# Altium project PCB_IC.PrjPCB
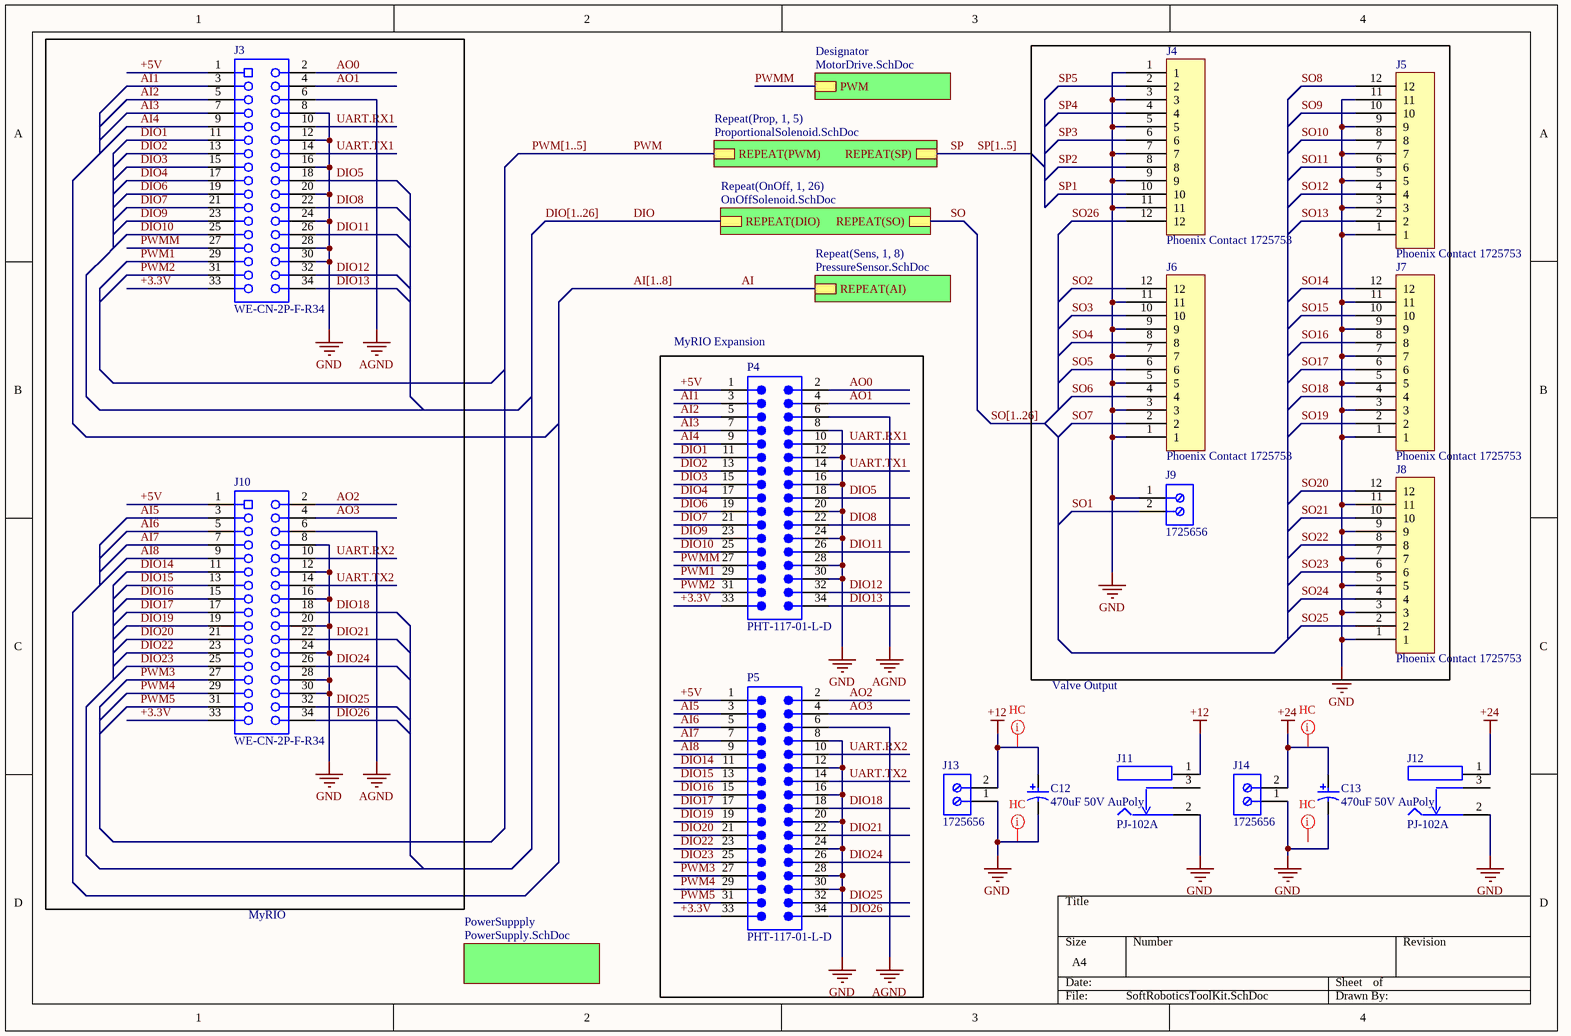
[diagram p0: SoftRoboticsToolKit.SchDoc]
6 sheets, 429 parts. Net scope: hierarchical (ports join the sheet entries above them; power ports are global).
Board file: PCB_IC.PcbDoc
Sheets:
  SoftRoboticsToolKit.SchDoc
    Designator = MotorDrive.SchDoc
    PowerSuppply = PowerSupply.SchDoc
    Prop1 = ProportionalSolenoid.SchDoc
    Prop2 = ProportionalSolenoid.SchDoc
    Prop3 = ProportionalSolenoid.SchDoc
    Prop4 = ProportionalSolenoid.SchDoc
    Prop5 = ProportionalSolenoid.SchDoc
    OnOff1 = OnOffSolenoid.SchDoc
    OnOff2 = OnOffSolenoid.SchDoc
    OnOff3 = OnOffSolenoid.SchDoc
    OnOff4 = OnOffSolenoid.SchDoc
    OnOff5 = OnOffSolenoid.SchDoc
    OnOff6 = OnOffSolenoid.SchDoc
    OnOff7 = OnOffSolenoid.SchDoc
    OnOff8 = OnOffSolenoid.SchDoc
    OnOff9 = OnOffSolenoid.SchDoc
    OnOff10 = OnOffSolenoid.SchDoc
    OnOff11 = OnOffSolenoid.SchDoc
    OnOff12 = OnOffSolenoid.SchDoc
    OnOff13 = OnOffSolenoid.SchDoc
    OnOff14 = OnOffSolenoid.SchDoc
    OnOff15 = OnOffSolenoid.SchDoc
    OnOff16 = OnOffSolenoid.SchDoc
    OnOff17 = OnOffSolenoid.SchDoc
    OnOff18 = OnOffSolenoid.SchDoc
    OnOff19 = OnOffSolenoid.SchDoc
    OnOff20 = OnOffSolenoid.SchDoc
    OnOff21 = OnOffSolenoid.SchDoc
    OnOff22 = OnOffSolenoid.SchDoc
    OnOff23 = OnOffSolenoid.SchDoc
    OnOff24 = OnOffSolenoid.SchDoc
    OnOff25 = OnOffSolenoid.SchDoc
    OnOff26 = OnOffSolenoid.SchDoc
    Sens1 = PressureSensor.SchDoc
    Sens2 = PressureSensor.SchDoc
    Sens3 = PressureSensor.SchDoc
    Sens4 = PressureSensor.SchDoc
    Sens5 = PressureSensor.SchDoc
    Sens6 = PressureSensor.SchDoc
    Sens7 = PressureSensor.SchDoc
    Sens8 = PressureSensor.SchDoc

## Sheet SoftRoboticsToolKit.SchDoc
size A4

### Parts
C12  470uF 50V AuPoly  [CAPAE137130X163M]
C13  470uF 50V AuPoly  [CAPAE137130X163M]
J3  WE-CN-2P-F-R34  [613034243121]
J4  Phoenix Contact 1725753  [PHOE-1725656-12]
J5  Phoenix Contact 1725753  [PHOE-1725656-12]
J6  Phoenix Contact 1725753  [PHOE-1725656-12]
J7  Phoenix Contact 1725753  [PHOE-1725656-12]
J8  Phoenix Contact 1725753  [PHOE-1725656-12]
J9  1725656  [PHOE-1725656-2]
J10  WE-CN-2P-F-R34  [613034243121]
J11  PJ-102A  [FP-PJ-102A-MFG]
J12  PJ-102A  [FP-PJ-102A-MFG]
J13  1725656  [PHOE-1725656-2]
J14  1725656  [PHOE-1725656-2]
P4  PHT-117-01-L-D  [PHT-117-01-L-D]
P5  PHT-117-01-L-D  [PHT-117-01-L-D]

### Blocks framed on the sheet
MyRIO Expansion: P4 P5

### Sub-sheets
Designator = MotorDrive.SchDoc: PWM
PowerSuppply = PowerSupply.SchDoc: no entries
Repeat(OnOff, 1, 26) = OnOffSolenoid.SchDoc: REPEAT(DIO), REPEAT(SO)
Repeat(Prop, 1, 5) = ProportionalSolenoid.SchDoc: REPEAT(PWM), REPEAT(SP)
Repeat(Sens, 1, 8) = PressureSensor.SchDoc: REPEAT(AI)

### Nets
+12: C12.1 J11.1 J13.2
+24: C13.1 J12.1 J14.2
AGND: J3.6 J10.6 P4.6 P5.6
GND: C12.2 C13.2 J3.8 J3.12 J3.16 J3.20 J3.24 J3.28 J3.30 J4.1 J4.3 J4.5 J4.7 J4.9 J4.11 J5.1 J5.3 J5.5 J5.7 J5.9 J5.11 J6.1 J6.3 J6.5 J6.7 J6.9 J6.11 J7.1 J7.3 J7.5 J7.7 J7.9 J7.11 J8.1 J8.3 J8.5 J8.7 J8.9 J8.11 J9.1 J10.8 J10.12 J10.16 J10.20 J10.24 J10.28 J10.30 J11.2 J12.2 J13.1 J14.1 P4.8 P4.12 P4.16 P4.20 P4.24 P4.28 P4.30 P5.8 P5.12 P5.16 P5.20 P5.24 P5.28 P5.30
+3.3V: J3.33 J10.33 P4.33 P5.33
+5V: J3.1 J10.1 P4.1 P5.1
AI: sheet Repeat(Sens, 1, 8)/REPEAT(AI)
AI1: J3.3 P4.3
AI2: J3.5 P4.5
AI3: J3.7 P4.7
AI4: J3.9 P4.9
AI5: J10.3 P5.3
AI6: J10.5 P5.5
AI7: J10.7 P5.7
AI8: J10.9 P5.9
AO0: J3.2 P4.2
AO1: J3.4 P4.4
AO2: J10.2 P5.2
AO3: J10.4 P5.4
DIO: sheet Repeat(OnOff, 1, 26)/REPEAT(DIO)
DIO1: J3.11 P4.11
DIO2: J3.13 P4.13
DIO3: J3.15 P4.15
DIO4: J3.17 P4.17
DIO5: J3.18 P4.18
DIO6: J3.19 P4.19
DIO7: J3.21 P4.21
DIO8: J3.22 P4.22
DIO9: J3.23 P4.23
DIO10: J3.25 P4.25
DIO11: J3.26 P4.26
DIO12: J3.32 P4.32
DIO13: J3.34 P4.34
DIO14: J10.11 P5.11
DIO15: J10.13 P5.13
DIO16: J10.15 P5.15
DIO17: J10.17 P5.17
DIO18: J10.18 P5.18
DIO19: J10.19 P5.19
DIO20: J10.21 P5.21
DIO21: J10.22 P5.22
DIO22: J10.23 P5.23
DIO23: J10.25 P5.25
DIO24: J10.26 P5.26
DIO25: J10.32 P5.32
DIO26: J10.34 P5.34
PWM: sheet Repeat(Prop, 1, 5)/REPEAT(PWM)
PWM1: J3.29 P4.29
PWM2: J3.31 P4.31
PWM3: J10.27 P5.27
PWM4: J10.29 P5.29
PWM5: J10.31 P5.31
PWMM: J3.27 P4.27 ; sheet Designator/PWM
SO: sheet Repeat(OnOff, 1, 26)/REPEAT(SO)
SO1: J9.2
SO2: J6.12
SO3: J6.10
SO4: J6.8
SO5: J6.6
SO6: J6.4
SO7: J6.2
SO8: J5.12
SO9: J5.10
SO10: J5.8
SO11: J5.6
SO12: J5.4
SO13: J5.2
SO14: J7.12
SO15: J7.10
SO16: J7.8
SO17: J7.6
SO18: J7.4
SO19: J7.2
SO20: J8.12
SO21: J8.10
SO22: J8.8
SO23: J8.6
SO24: J8.4
SO25: J8.2
SO26: J4.12
SP: sheet Repeat(Prop, 1, 5)/REPEAT(SP)
SP1: J4.10
SP2: J4.8
SP3: J4.6
SP4: J4.4
SP5: J4.2
UART.RX1: J3.10 P4.10
UART.RX2: J10.10 P5.10
UART.TX1: J3.14 P4.14
UART.TX2: J10.14 P5.14

Not connected (* = marked no-connect by the designer): J11 3; J12 3

### Buses and harness runs
bus AI[1..8]
bus DIO[1..26]
bus PWM[1..5]
bus SO[1..26]
bus SP[1..5]

### Layout directives
net class HC: (no net found under the mark), +12, +24, GND

### Notes on the sheet
- Valve Output
- MyRIO

### Library data of the parts
C12 C13 = C-Poly: Manufacturer: AVX; DELETED: Compliant; Product Depth (mm): 4.3mm; Product Length (mm): 7.3mm; Case Style: Molded; Product Diameter (mm): NotRequiredmm; DF: 6%; Seal: NotRequired; Capacitance: 22000000pF; Product Height (mm): 2.9mm; Rad Hardened: No; ESR: 0.2ohm; Polarity: Polar; DCL: 5.5uA; Voltage: 25VDC; Tolerance (+ or -): 10%; Construction: SMTChip; Mounting Style: SurfaceMount; Packaging: TapeandReel; Case Code: D; Package Reference: 7343-31; Manufacturer URL: http://www.avx.com/; Failure Rate: NotRequired; Insulation: NotRequired; Operating Temp Range: -55Cto125C; Mounting Technology: SurfaceMount; Package Description: 2-Pin Surface Mount Device, Body 7.3 x 4.35 mm; Length W/Weld (max): NotRequiredmm; Lead Spacing (nom): NotRequiredmm; Seated Plane Height: NotRequiredmm; Wire Form: NotRequired; Datasheet Version: 02/2004; Datasheet URL: https://datasheet.ciiva.com/11793/0900766b80066cb4-11793194.pdf; Length W/Weld: NotRequiredmm; Package / Case: 7343-31
J4-J8 = 1725753
J9 J13 J14 = CMP-2000-05299-1: Male Header, Pitch 2.54 mm, 1 x 2 Position, Height 9 mm, Tail Length 3.5 mm; Manufacturer: Phoenix Contact; Number of contacts: 2; Content: 250pc(s); Pitch: 2.54mm; Industrial packaging: Yes; Colour: Green; Manufacturer part No.: 1725656; Type: MPT0,5/2-2,54; Datasheet URL: http://datasheet.octopart.com/1725656-Phoenix-Contact-datasheet-5302866.pdf; Manufacturer URL: http://www.phoenixcontact.com/; Datasheet Version: Apr-08
J11 J12 = CMP-14830-000006-1: CONN PWR JACK 2X5.5MM SOLDER; Manufacturer: CUI; Conn Gender: Male; Voltage: 24V; Industry Recognized Mating Diameter: 2.10mm ID (0.083"), 5.50mm OD (0.217"); Number Of Contacts: 3; Number of Positions/Contacts: 2 Conductors, 3 Contacts; Current Rating: 2.5A; Conn Orientation: Right Angle; ComponentLink2URL: http://www.cui.com/product/resource/pj-102a.pdf; Manufacturer Part Number: PJ-102A; Contact Material: Tin,Nickel; Digikey Description: CONN PWR JACK 2X5.5MM SOLDER; RoHS: TRUE; Height: 11.2mm; Category: Conn; Octopart: https://octopart.com/pj-102a-cui-286936; Device Class L1: Connectors; Automotive: No; Package: PJ-102A; Device Class L2: Power Connectors; Temperature Range Low: -25°C; Temperature: -25°C to +85°C; Mouser Description: DC Power Connectors Power Jacks; Lead Free: Yes; Device Class L3: unset; Voltage Rating: 24V; ComponentLink2Description: Datasheet; Temperature Range High: +85°C

## Sheet MotorDrive.SchDoc
size A4
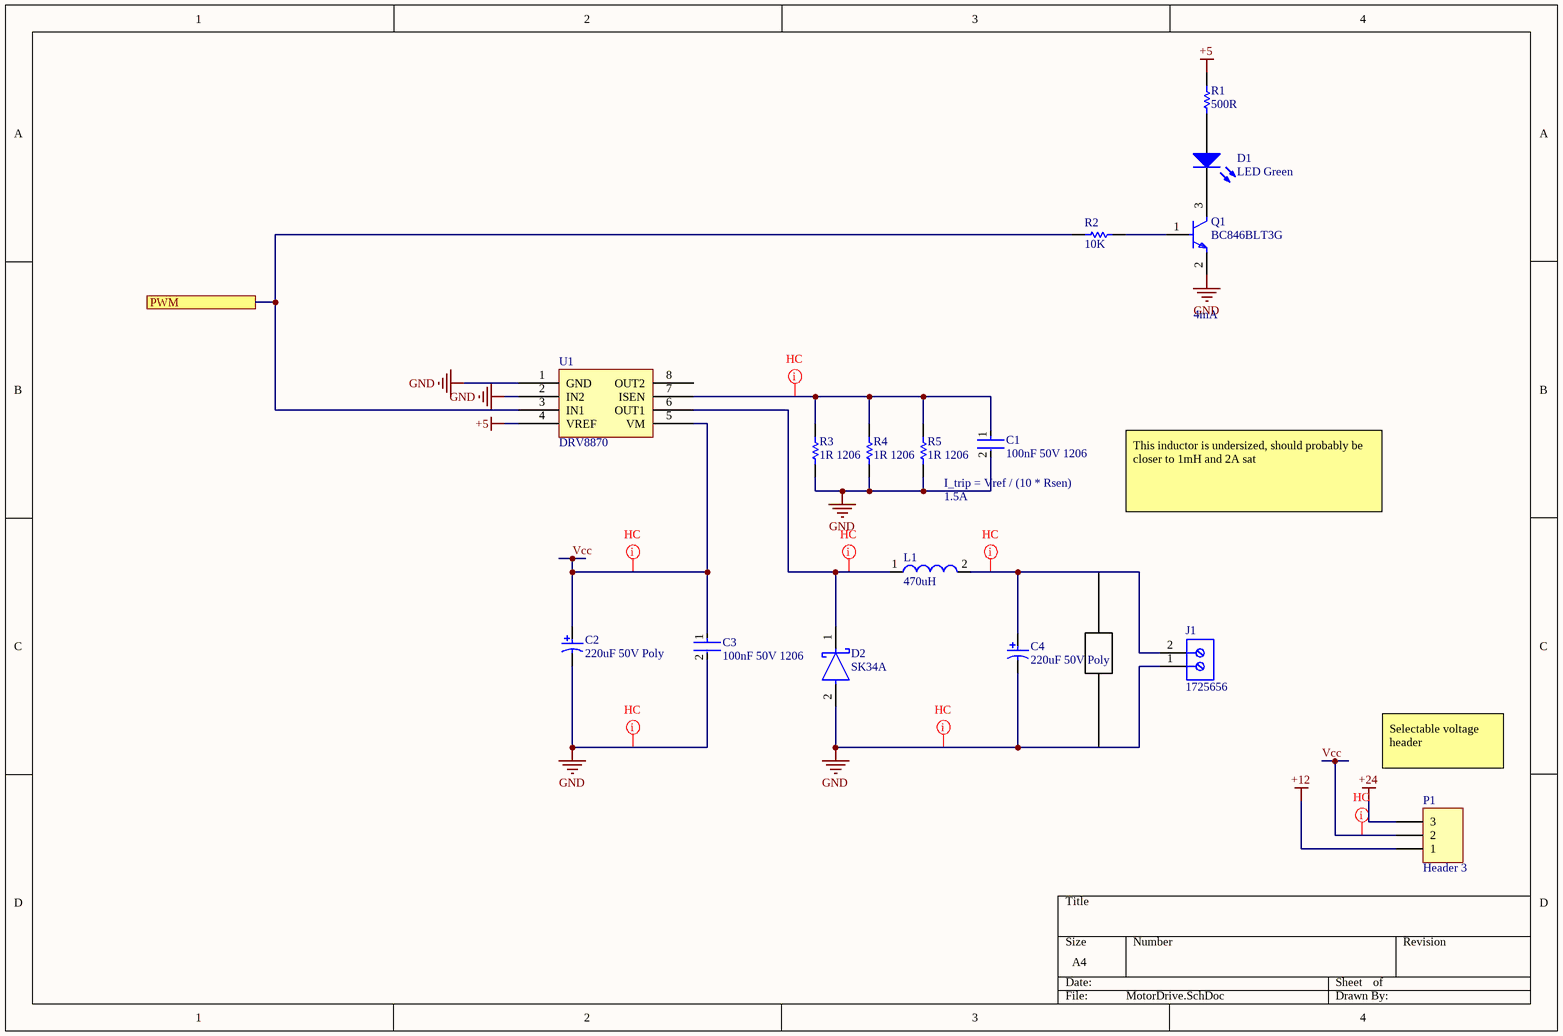
[diagram p1: MotorDrive.SchDoc]

### Parts
C1  100nF 50V 1206  [FP-CL31-IPC_B]
C2  220uF 50V Poly  [CAPAE127P600-8N]
C3  100nF 50V 1206  [FP-CL31-IPC_B]
C4  220uF 50V Poly  [CAPAE127P600-8N]
D1  LED Green  [0603_A]
D2  SK34A  [FP-DO-214AC-MFG]
J1  1725656  [PHOE-1725656-2]
L1  470uH  [L1212]
P1  Header 3  [HDR1X3]
Q1  BC846BLT3G  [FP-318-08-IPC_C]
R1  500R  [RESC0603(1608)_L]
R2  10K  [RESC0603(1608)_N]
R3  1R 1206  [RESC1206(3216)_N]
R4  1R 1206  [RESC1206(3216)_N]
R5  1R 1206  [RESC1206(3216)_N]
U1  DRV8870  [SOIC127P600X170_HS-9N]

### Ports
PWM

### Nets
+5: R1.2 U1.4(VREF)
+12: P1.1
+24: P1.3
GND: C1.2 C2.2 C3.2 C4.2 D2.2(A) J1.1 Q1.2(E) R3.1 R4.1 R5.1 U1.1(GND) U1.2(IN2)
PWMM: R2.1 U1.3(IN1) ; port PWM
Vcc: C2.1 C3.1 P1.2 U1.5(VM)
NetC1_1: C1.1 R3.2 R4.2 R5.2 U1.7(ISEN)
NetC4_1: C4.1 J1.2 L1.2
NetD1_1: D1.1(K) Q1.3(C)
NetD1_2: D1.2(A) R1.1
NetD2_1: D2.1(C) L1.1 U1.6(OUT1)
NetQ1_1: Q1.1(B) R2.2

Not connected (* = marked no-connect by the designer): U1 8(OUT2)

### Layout directives
net class HC: GND, NetC1_1, NetC4_1, NetD2_1, Vcc

### Notes on the sheet
- 4mA
- I_trip = Vref / (10 * Rsen)
- 1.5A
- This inductor is undersized, should probably be closer to 1mH and 2A sat
- Selectable voltage header

### Library data of the parts
C1 C3 = CMP-13271-001276-1: Cap Ceramic 100nF 50V X7R ±10% SMD 1206 +125°C Embossed T/R; Dielectric: X7R; Case Code (Metric): 3216; Package Quantity: 1; Thickness: 0.037inch; Depth: 1.6mm; Packaging: Tape and Reel; Capacitance: 100nF; Length: 0.126inch; Tolerance: 10%; Voltage Rating: 50V; Case Code (Imperial): 1206; Radiation Hardening: No; Width: 0.063inch; Case/Package: 1206; Max Operating Temperature: 125°C; Min Operating Temperature: -55°C; Height: 0.85mm; Mount: Surface Mount
C2 C4 = C-Poly: as C12 on sheet SoftRoboticsToolKit; Construction: SMTChip; Mounting Style: SurfaceMount; Packaging: TapeandReel; Case Code: D; Package Reference: 7343-31; Manufacturer URL: http://www.avx.com/; Failure Rate: NotRequired; Insulation: NotRequired; Operating Temp Range: -55Cto125C; Mounting Technology: SurfaceMount; Package Description: 2-Pin Surface Mount Device, Body 7.3 x 4.35 mm; Length W/Weld (max): NotRequiredmm; Lead Spacing (nom): NotRequiredmm; Seated Plane Height: NotRequiredmm; Wire Form: NotRequired; Datasheet Version: 02/2004; Datasheet URL: https://datasheet.ciiva.com/11793/0900766b80066cb4-11793194.pdf; Length W/Weld: NotRequiredmm; Package / Case: 7343-31
D1 = CMP-1426-00002-1: SMD mono-color Chip LED, WL-SMCW, Green; PartNumber: 150060GS75000; Manufacturer: Wuerth Elektronik; ComponentLink1URL: http://www.we-online.com; ComponentLink2Description: Datasheet; Color: Green; ComponentLink2URL: http://katalog.we-online.com/led/datasheet/150060GS75000.pdf; PackageReference: 0603_A; ComponentLink1Description: Manufacturer URL
D2 = CMP-56206-000004-1: DIODE SCHOTTKY 5A 30V SMA; Mount: Surface Mount; Max Reverse Voltage (DC): 30V; Case/Package: SMA; Packaging: Tape and Reel; Average Rectified Current: 5A
J1 = CMP-2000-05299-1: as J9 on sheet SoftRoboticsToolKit; Colour: Green; Manufacturer part No.: 1725656; Type: MPT0,5/2-2,54; Datasheet URL: http://datasheet.octopart.com/1725656-Phoenix-Contact-datasheet-5302866.pdf; Manufacturer URL: http://www.phoenixcontact.com/; Datasheet Version: Apr-08
L1 = Inductor1212: Manufacturer: Wuerth Elektronik; PartNumber: 74479763215; Inductance: 1.50 ÂµH; ComponentLink1Description: Manufacturer URL; PackageReference: SMD 0603_A; ComponentLink1URL: http://www.we-online.com; ComponentLink2URL: http://katalog.we-online.de/kataloge/eisos/media/pdf/74479763215.pdf; ComponentLink2Description: Datasheet
P1 = Header 3: Header, 3-Pin; LatestRevisionDate: 17-Jul-2002; LatestRevisionNote: Re-released for DXP Platform.; Publisher: Altium Limited
Q1 = CMP-07170-000022-1: TRANS NPN 65V 0.1A SOT-23; Number of Elements: 1; Collector Emitter Saturation Voltage: 600mV; Power Dissipation: 300mW; hFE Min: 200; Transition Frequency: 100MHz; Max Collector Current: 100mA; Collector Base Voltage (VCBO): 80V; Emitter Base Voltage (VEBO): 6V; Element Configuration: Single; REACH SVHC: No SVHC; Length: 2.9mm; Polarity: NPN; Max Breakdown Voltage: 65V; Case/Package: SOT-23-3; Max Operating Temperature: 150°C; Min Operating Temperature: -55°C; Voltage Rating (DC): 65V; Number of Pins: 3; Radiation Hardening: No; Package Quantity: 1; Contact Plating: Tin; Max Frequency: 100MHz; Width: 1.3mm; Max Power Dissipation: 300mW; Height: 1mm; Lead Free: Lead Free; Frequency: 100MHz; Halogen Free: Halogen Free; Collector Emitter Voltage (VCEO): 65V; Gain Bandwidth Product: 100MHz; Current Rating: 100mA; Collector Emitter Breakdown Voltage: 65V; Packaging: Tape and Reel
R1 = CMP-1012-00067-1: 510R 0.1W 5% 0603 (1608 Metric)  SMD; Case-EIA: 0603; Value: 510.00 Ohm; Case-Metric: 1608; Technology: SMT; Power: 0.1 W; Tolerance: 5 %
R2 = CMP-1012-00623-1: 10K 0.1W 1% 0603 (1608 Metric)  SMD; Value: 10000.00 Ohm; Case-EIA: 0603; Case-Metric: 1608; Power: 0.1 W; Tolerance: 1 %; Technology: SMT
R3-R5 = CMP-1014-00004-1: 1R2 0.25W 5% 1206 (3216 Metric)  SMD; Value: 1.20 Ohm; Case-Metric: 3216; Case-EIA: 1206; Power: 0.25 W; Technology: SMT; Tolerance: 5 %

## Sheet PowerSupply.SchDoc
size A4
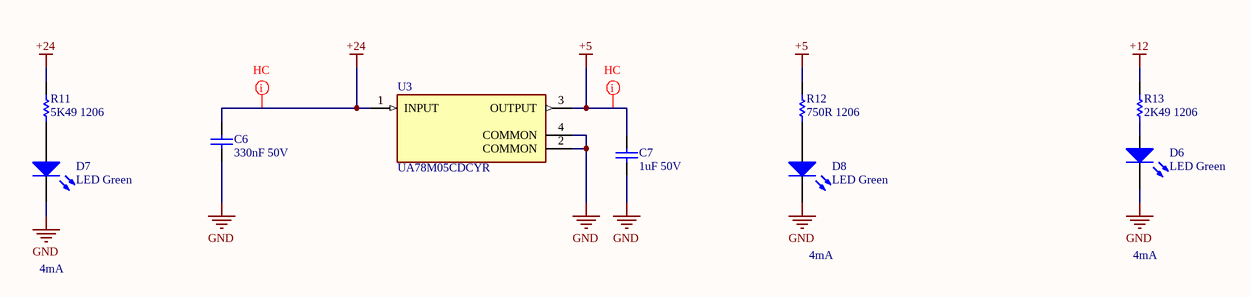
[diagram p2: PowerSupply.SchDoc]

### Parts
C6  330nF 50V  [CAPC0603(1608)100_L]
C7  1uF 50V  [CAPC0603(1608)100_L]
D6  LED Green  [0603_A]
D7  LED Green  [0603_A]
D8  LED Green  [0603_A]
R11  5K49 1206  [R-1206]
R12  750R 1206  [R-1206]
R13  2K49 1206  [R-1206]
U3  UA78M05CDCYR  [FP-DCY0004A-MFG]

### Nets
+5: C7.1 R12.2 U3.3(OUTPUT)
+12: R13.2
+24: C6.2 R11.2 U3.1(INPUT)
GND: C6.1 C7.2 D6.1(K) D7.1(K) D8.1(K) U3.2(COMMON) U3.4(COMMON)
NetD6_2: D6.2(A) R13.1
NetD7_2: D7.2(A) R11.1
NetD8_2: D8.2(A) R12.1

### Layout directives
net class HC: +5, +24

### Notes on the sheet
- 4mA

### Library data of the parts
C6 = CMP-1035-02677-1: CAP 330nF 35V ±10% 0603 (1608 Metric) Thickness 1mm SMD; Case-EIA: 0603; Case-Metric: 1608; Tolerance: Â±10%; Technology: SMT; Max Thickness: 1 mm; Value: 330nF; Rated Voltage: 35 V
C7 = CMP-1035-02743-1: CAP 1uF 35V ±10% 0603 (1608 Metric) Thickness 1mm SMD; Case-Metric: 1608; Case-EIA: 0603; Tolerance: Â±10%; Max Thickness: 1 mm; Value: 1uF; Technology: SMT; Rated Voltage: 35 V
D6-D8 = CMP-1426-00002-1: as D1 on sheet MotorDrive; ComponentLink1URL: http://www.we-online.com; ComponentLink2Description: Datasheet; Color: Green; ComponentLink2URL: http://katalog.we-online.com/led/datasheet/150060GS75000.pdf; PackageReference: 0603_A; ComponentLink1Description: Manufacturer URL
R11-R13 = R-1206: 0.25W 1206; Power: 0.1 W; Value: 10000.00 Ohm; Tolerance: 1 %; Case-EIA: 0603; Case-Metric: 1608; Technology: SMT
U3 = CMP-04917-000015-1: IC REG LINEAR 5V 500MA SOT223-4; Manufacturer: Texas Instruments; Accuracy Percentage: 3%; Dropout Voltage: 2V; Max Supply Voltage: 25V; Min Supply Voltage: 7V; Nominal Supply Current: 4.5mA; Max Junction Temp: +125°C; Number Of Outputs: 1; Output Type: Fixed; Standoff Height: 0.02mm; Automotive: No; ComponentLink2URL: http://www.ti.com/lit/ds/symlink/ua78m.pdf; ComponentLink2Description: Datasheet; Category: IC; Output Voltage: 5V; Lead Free: Yes; Height: 1.8mm; Temperature Range Low: 0°C; Octopart: https://octopart.com/ua78m05cdcyr-texas+instruments-525243; Device Class L3: Voltage Regulators - Linear; Mouser Description: Linear Voltage Regulators 5.0V 500mA Fxd Pos; Device Class L1: Integrated Circuits (ICs); RoHS: TRUE; Output Current: 500mA; Temperature Range High: +125°C; Manufacturer Part Number: UA78M05CDCYR; Device Class L2: Power Management ICs; Digikey Description: IC REG LINEAR 5V 500MA SOT223-4; Package: DCY0004A; Temperature: 0°C to +125°C

## Sheet ProportionalSolenoid.SchDoc
size A4
Used 5 times, as channels Prop1, Prop2, Prop3, Prop4, Prop5. Parts and nets are listed once, with the designators drawn on the sheet.
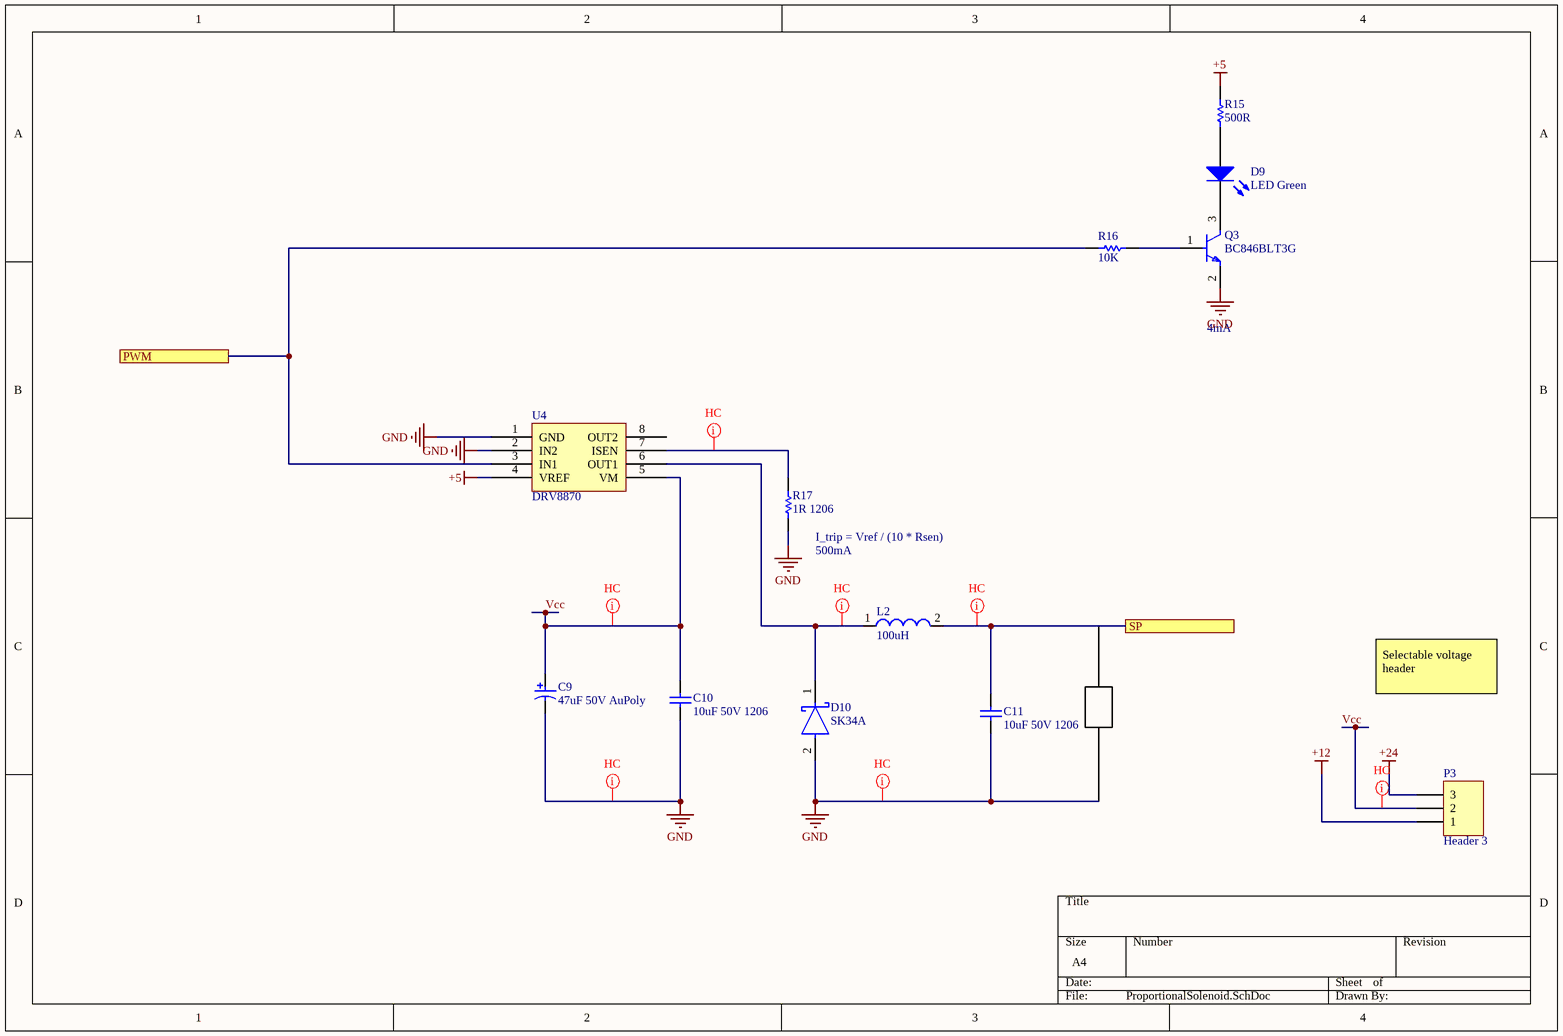
[diagram p3: ProportionalSolenoid.SchDoc]

### Parts
C9  47uF 50V AuPoly  [EEH-ZA1H220P]
C10  10uF 50V 1206  [CAPC1206(3216)190_N]
C11  10uF 50V 1206  [CAPC1206(3216)190_N]
D9  LED Green  [0603_A]
D10  SK34A  [FP-DO-214AC-MFG]
L2  100uH  [L0404]
P3  Header 3  [HDR1X3]
Q3  BC846BLT3G  [FP-318-08-IPC_C]
R15  500R  [RESC0603(1608)_L]
R16  10K  [RESC0603(1608)_N]
R17  1R 1206  [RESC1206(3216)_N]
U4  DRV8870  [SOIC127P600X170_HS-9N]

### Ports
PWM, SP

### Nets
+5: R15.2 U4.4(VREF)
+12: P3.1
+24: P3.3
GND: C9.2 C10.1 C11.1 D10.2(A) Q3.2(E) R17.1 U4.1(GND) U4.2(IN2)
PWM: R16.1 U4.3(IN1) ; port PWM
SP: C11.2 L2.2 ; port SP
Vcc: C9.1 C10.2 P3.2 U4.5(VM)
NetD9_1: D9.1(K) Q3.3(C)
NetD9_2: D9.2(A) R15.1
NetD10_1: D10.1(C) L2.1 U4.6(OUT1)
NetQ3_1: Q3.1(B) R16.2
NetR17_2: R17.2 U4.7(ISEN)

Not connected (* = marked no-connect by the designer): U4 8(OUT2)

### Channels
Prop1: designators end in _Prop1; ports PWM=PWM1 SP=SP1
Prop2: designators end in _Prop2; ports PWM=PWM2 SP=SP2
Prop3: designators end in _Prop3; ports PWM=PWM3 SP=SP3
Prop4: designators end in _Prop4; ports PWM=PWM4 SP=SP4
Prop5: designators end in _Prop5; ports PWM=PWM5 SP=SP5

### Layout directives
net class HC: GND, NetD10_Prop1_1, NetR17_Prop1_2, SP1, Vcc_Prop1

### Notes on the sheet
- 4mA
- (near R17) I_trip = Vref / (10 * Rsen)
- (near R17) 500mA
- Selectable voltage header

### Library data of the parts
C9 = C-Poly: as C12 on sheet SoftRoboticsToolKit; Construction: SMTChip; Mounting Style: SurfaceMount; Packaging: TapeandReel; Case Code: D; Package Reference: 7343-31; Manufacturer URL: http://www.avx.com/; Failure Rate: NotRequired; Insulation: NotRequired; Operating Temp Range: -55Cto125C; Mounting Technology: SurfaceMount; Package Description: 2-Pin Surface Mount Device, Body 7.3 x 4.35 mm; Length W/Weld (max): NotRequiredmm; Lead Spacing (nom): NotRequiredmm; Seated Plane Height: NotRequiredmm; Wire Form: NotRequired; Datasheet Version: 02/2004; Datasheet URL: https://datasheet.ciiva.com/11793/0900766b80066cb4-11793194.pdf; Length W/Weld: NotRequiredmm; Package / Case: 7343-31
C10 C11 = CMP-1037-04983-1: CAP 10uF 50V ±20% 1206 (3216 Metric) Thickness 1.9mm SMD; Tolerance: Â±20%; Case-Metric: 3216; Case-EIA: 1206; Technology: SMT; Max Thickness: 1.9 mm; Rated Voltage: 50 V; Value: 10uF
D9 = CMP-1426-00002-1: as D1 on sheet MotorDrive; ComponentLink1URL: http://www.we-online.com; ComponentLink2Description: Datasheet; Color: Green; ComponentLink2URL: http://katalog.we-online.com/led/datasheet/150060GS75000.pdf; PackageReference: 0603_A; ComponentLink1Description: Manufacturer URL
D10 = CMP-56206-000004-1: DIODE SCHOTTKY 5A 30V SMA; Mount: Surface Mount; Max Reverse Voltage (DC): 30V; Case/Package: SMA; Packaging: Tape and Reel; Average Rectified Current: 5A
L2 = Inductor0404: Manufacturer: Wuerth Elektronik; PartNumber: 74479763215; Inductance: 1.50 ÂµH; ComponentLink1Description: Manufacturer URL; PackageReference: SMD 0603_A; ComponentLink1URL: http://www.we-online.com; ComponentLink2URL: http://katalog.we-online.de/kataloge/eisos/media/pdf/74479763215.pdf; ComponentLink2Description: Datasheet
P3 = Header 3: Header, 3-Pin; LatestRevisionDate: 17-Jul-2002; LatestRevisionNote: Re-released for DXP Platform.; Publisher: Altium Limited
Q3 = CMP-07170-000022-1: as Q1 on sheet MotorDrive; REACH SVHC: No SVHC; Length: 2.9mm; Polarity: NPN; Max Breakdown Voltage: 65V; Case/Package: SOT-23-3; Max Operating Temperature: 150°C; Min Operating Temperature: -55°C; Voltage Rating (DC): 65V; Number of Pins: 3; Radiation Hardening: No; Package Quantity: 1; Contact Plating: Tin; Max Frequency: 100MHz; Width: 1.3mm; Max Power Dissipation: 300mW; Height: 1mm; Lead Free: Lead Free; Frequency: 100MHz; Halogen Free: Halogen Free; Collector Emitter Voltage (VCEO): 65V; Gain Bandwidth Product: 100MHz; Current Rating: 100mA; Collector Emitter Breakdown Voltage: 65V; Packaging: Tape and Reel
R15 = CMP-1012-00067-1: as R1 on sheet MotorDrive; Technology: SMT; Power: 0.1 W; Tolerance: 5 %
R16 = CMP-1012-00623-1: as R2 on sheet MotorDrive; Power: 0.1 W; Tolerance: 1 %; Technology: SMT
R17 = CMP-1014-00004-1: as R3 on sheet MotorDrive; Power: 0.25 W; Technology: SMT; Tolerance: 5 %

## Sheet OnOffSolenoid.SchDoc
size A4
Used 26 times, as channels OnOff1, OnOff2, OnOff3, OnOff4, OnOff5, OnOff6, OnOff7, OnOff8, OnOff9, OnOff10, OnOff11, OnOff12, OnOff13, OnOff14, OnOff15, OnOff16, OnOff17, OnOff18, OnOff19, OnOff20, OnOff21, OnOff22, OnOff23, OnOff24, OnOff25, OnOff26. Parts and nets are listed once, with the designators drawn on the sheet.
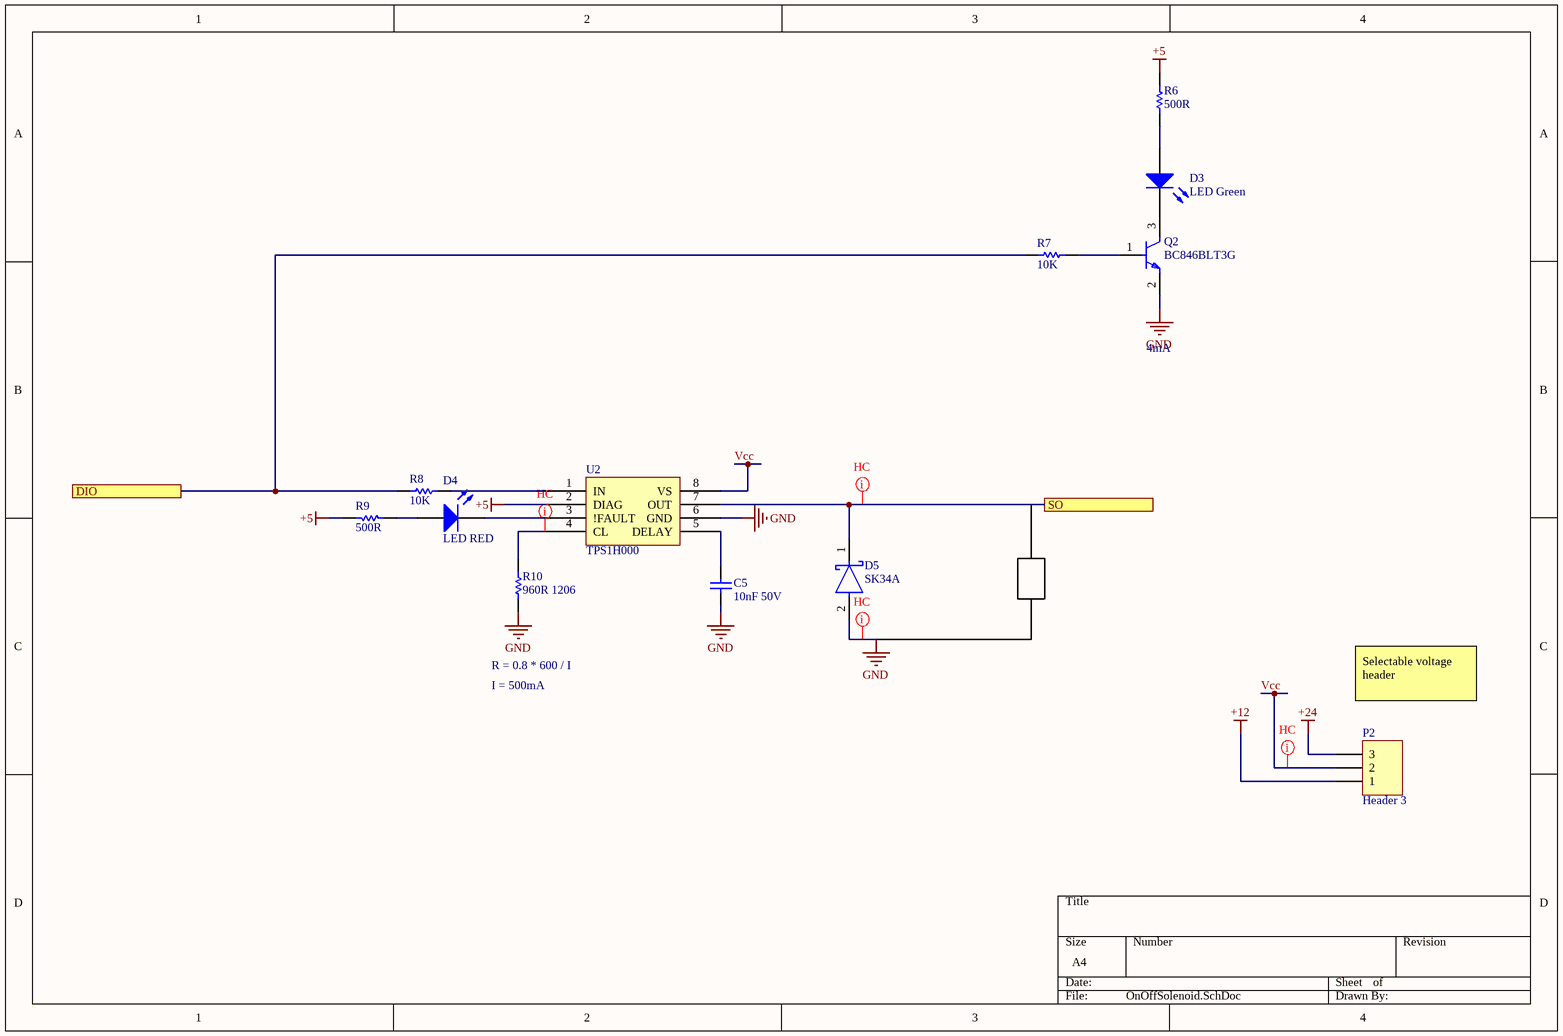
[diagram p4: OnOffSolenoid.SchDoc]

### Parts
C5  10nF 50V  [CAPC0603(1608)100_L]
D3  LED Green  [0603_A]
D4  LED RED  [0603_A]
D5  SK34A  [FP-DO-214AC-MFG]
P2  Header 3  [HDR1X3]
Q2  BC846BLT3G  [FP-318-08-IPC_C]
R6  500R  [RESC0603(1608)_L]
R7  10K  [RESC0603(1608)_N]
R8  10K  [RESC0603(1608)_N]
R9  500R  [RESC0603(1608)_L]
R10  960R 1206  [RESC1206(3216)_L]
U2  TPS1H000  [TSOP65P490X110_HS-9N]

### Ports
DIO, SO

### Nets
+5: R6.2 R9.2 U2.2(DIAG)
+12: P2.1
+24: P2.3
GND: C5.1 D5.2(A) Q2.2(E) R10.1 U2.6(GND)
DIO: R7.1 R8.1 ; port DIO
SO: D5.1(C) U2.7(OUT) ; port SO
Vcc: P2.2 U2.8(VS)
NetC5_2: C5.2 U2.5(DELAY)
NetD3_1: D3.1(K) Q2.3(C)
NetD3_2: D3.2(A) R6.1
NetD4_1: D4.1(K) U2.3(!FAULT)
NetD4_2: D4.2(A) R9.1
NetQ2_1: Q2.1(B) R7.2
NetR8_2: R8.2 U2.1(IN)
NetR10_2: R10.2 U2.4(CL)

### Channels
OnOff1: designators end in _OnOff1; ports DIO=DIO1 SO=SO1
OnOff2: designators end in _OnOff2; ports DIO=DIO2 SO=SO2
OnOff3: designators end in _OnOff3; ports DIO=DIO3 SO=SO3
OnOff4: designators end in _OnOff4; ports DIO=DIO4 SO=SO4
OnOff5: designators end in _OnOff5; ports DIO=DIO5 SO=SO5
OnOff6: designators end in _OnOff6; ports DIO=DIO6 SO=SO6
OnOff7: designators end in _OnOff7; ports DIO=DIO7 SO=SO7
OnOff8: designators end in _OnOff8; ports DIO=DIO8 SO=SO8
OnOff9: designators end in _OnOff9; ports DIO=DIO9 SO=SO9
OnOff10: designators end in _OnOff10; ports DIO=DIO10 SO=SO10
OnOff11: designators end in _OnOff11; ports DIO=DIO11 SO=SO11
OnOff12: designators end in _OnOff12; ports DIO=DIO12 SO=SO12
OnOff13: designators end in _OnOff13; ports DIO=DIO13 SO=SO13
OnOff14: designators end in _OnOff14; ports DIO=DIO14 SO=SO14
OnOff15: designators end in _OnOff15; ports DIO=DIO15 SO=SO15
OnOff16: designators end in _OnOff16; ports DIO=DIO16 SO=SO16
OnOff17: designators end in _OnOff17; ports DIO=DIO17 SO=SO17
OnOff18: designators end in _OnOff18; ports DIO=DIO18 SO=SO18
OnOff19: designators end in _OnOff19; ports DIO=DIO19 SO=SO19
OnOff20: designators end in _OnOff20; ports DIO=DIO20 SO=SO20
OnOff21: designators end in _OnOff21; ports DIO=DIO21 SO=SO21
OnOff22: designators end in _OnOff22; ports DIO=DIO22 SO=SO22
OnOff23: designators end in _OnOff23; ports DIO=DIO23 SO=SO23
OnOff24: designators end in _OnOff24; ports DIO=DIO24 SO=SO24
OnOff25: designators end in _OnOff25; ports DIO=DIO25 SO=SO25
OnOff26: designators end in _OnOff26; ports DIO=DIO26 SO=SO26

### Layout directives
net class HC: GND, NetR10_OnOff1_2, SO1, Vcc_OnOff1

### Notes on the sheet
- 4mA
- R = 0.8 * 600 / I
- I = 500mA
- Selectable voltage header

### Library data of the parts
C5 = CMP-1035-02322-1: CAP 10nF 50V ±20% 0603 (1608 Metric) Thickness 1mm SMD; Case-Metric: 1608; Tolerance: Â±20%; Case-EIA: 0603; Rated Voltage: 50 V; Value: 10nF; Max Thickness: 1 mm; Technology: SMT
D3 = CMP-1426-00002-1: as D1 on sheet MotorDrive; ComponentLink1URL: http://www.we-online.com; ComponentLink2Description: Datasheet; Color: Green; ComponentLink2URL: http://katalog.we-online.com/led/datasheet/150060GS75000.pdf; PackageReference: 0603_A; ComponentLink1Description: Manufacturer URL
D4 = CMP-1426-00001-1: SMD mono-color Chip LED, WL-SMCW, Red; Manufacturer: Wuerth Elektronik; PartNumber: 150060RS75000; Color: Red; PackageReference: 0603_A; ComponentLink2URL: http://katalog.we-online.com/led/datasheet/150060RS75000.pdf; ComponentLink1URL: http://www.we-online.com; ComponentLink1Description: Manufacturer URL; ComponentLink2Description: Datasheet
D5 = CMP-56206-000004-1: DIODE SCHOTTKY 5A 30V SMA; Mount: Surface Mount; Max Reverse Voltage (DC): 30V; Case/Package: SMA; Packaging: Tape and Reel; Average Rectified Current: 5A
P2 = Header 3: Header, 3-Pin; LatestRevisionDate: 17-Jul-2002; LatestRevisionNote: Re-released for DXP Platform.; Publisher: Altium Limited
Q2 = CMP-07170-000022-1: as Q1 on sheet MotorDrive; REACH SVHC: No SVHC; Length: 2.9mm; Polarity: NPN; Max Breakdown Voltage: 65V; Case/Package: SOT-23-3; Max Operating Temperature: 150°C; Min Operating Temperature: -55°C; Voltage Rating (DC): 65V; Number of Pins: 3; Radiation Hardening: No; Package Quantity: 1; Contact Plating: Tin; Max Frequency: 100MHz; Width: 1.3mm; Max Power Dissipation: 300mW; Height: 1mm; Lead Free: Lead Free; Frequency: 100MHz; Halogen Free: Halogen Free; Collector Emitter Voltage (VCEO): 65V; Gain Bandwidth Product: 100MHz; Current Rating: 100mA; Collector Emitter Breakdown Voltage: 65V; Packaging: Tape and Reel
R6 R9 = CMP-1012-00067-1: as R1 on sheet MotorDrive; Technology: SMT; Power: 0.1 W; Tolerance: 5 %
R7 R8 = CMP-1012-00623-1: as R2 on sheet MotorDrive; Power: 0.1 W; Tolerance: 1 %; Technology: SMT
R10 = CMP-1014-00508-1: 953R 0.25W 1% 1206 (3216 Metric)  SMD; Case-Metric: 3216; Value: 953.00 Ohm; Case-EIA: 1206; Tolerance: 1 %; Technology: SMT; Power: 0.25 W

## Sheet PressureSensor.SchDoc
size A4
Used 8 times, as channels Sens1, Sens2, Sens3, Sens4, Sens5, Sens6, Sens7, Sens8. Parts and nets are listed once, with the designators drawn on the sheet.
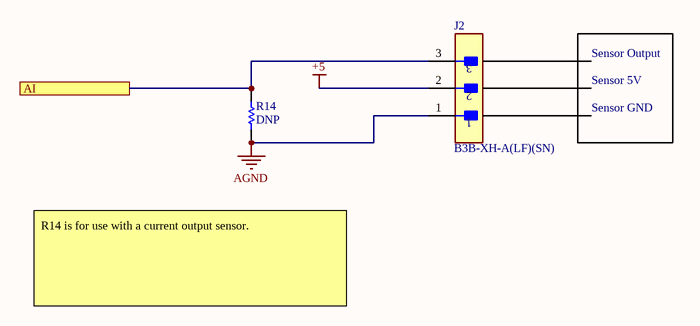
[diagram p5: PressureSensor.SchDoc]

### Parts
J2  B3B-XH-A(LF)(SN)  [FP-B3B-XH-A_LF_SN-MFG]
R14  DNP  [RESC0603(1608)_L]

### Ports
AI

### Nets
+5: J2.2
AGND: J2.1 R14.2
AI: J2.3 R14.1 ; port AI

### Channels
Sens1: designators end in _Sens1; ports AI=AI1
Sens2: designators end in _Sens2; ports AI=AI2
Sens3: designators end in _Sens3; ports AI=AI3
Sens4: designators end in _Sens4; ports AI=AI4
Sens5: designators end in _Sens5; ports AI=AI5
Sens6: designators end in _Sens6; ports AI=AI6
Sens7: designators end in _Sens7; ports AI=AI7
Sens8: designators end in _Sens8; ports AI=AI8

### Notes on the sheet
- Sensor Output
- Sensor 5V
- Sensor GND
- R14 is for use with a current output sensor.

### Library data of the parts
J2 = CMP-17439-000014-1: CONN HEADER VERT 3POS 2.5MM; Manufacturer: JST; Conn Gender: Male; Conn Orientation: Vertical; Voltage Rating: 250V; Number Of Contacts: 3; Current Rating: 3A; Contact Material: Tin,Copper; Temperature Range Low: -25°C; Octopart: https://octopart.com/b3b-xh-a%28lf%29%28sn%29-jst-3990185; Device Class L3: unset; Device Class L1: Connectors; Lead Free: Yes; Temperature: -25°C to +85°C; Manufacturer Part Number: B3B-XH-A(LF)(SN); Package: 0; ComponentLink2Description: Datasheet; Pitch: 2.5mm; RoHS: TRUE; Category: Conn; Automotive: No; Temperature Range High: +85°C; Height: 7mm; Device Class L2: Headers and Wire Housings; Number Of Rows: 1; Digikey Description: CONN HEADER VERT 3POS 2.5MM; ComponentLink2URL: https://www.jst-mfg.com/product/pdf/eng/eXH.pdf
R14 = CMP-1012-00440-1: 249R 0.1W 1% 0603 (1608 Metric)  SMD; Value: 249.00 Ohm; Case-Metric: 1608; Case-EIA: 0603; Technology: SMT; Tolerance: 1 %; Power: 0.1 W

## Nets that join several sheets
+5: MotorDrive (R1.2 U1.4), PowerSupply (C7.1 R12.2 U3.3), Prop1 (R15_Prop1.2 U4_Prop1.4), Prop2 (R15_Prop2.2 U4_Prop2.4), Prop3 (R15_Prop3.2 U4_Prop3.4), Prop4 (R15_Prop4.2 U4_Prop4.4), Prop5 (R15_Prop5.2 U4_Prop5.4), OnOff1 (R6_OnOff1.2 R9_OnOff1.2 U2_OnOff1.2), OnOff2 (R6_OnOff2.2 R9_OnOff2.2 U2_OnOff2.2), OnOff3 (R6_OnOff3.2 R9_OnOff3.2 U2_OnOff3.2), OnOff4 (R6_OnOff4.2 R9_OnOff4.2 U2_OnOff4.2), OnOff5 (R6_OnOff5.2 R9_OnOff5.2 U2_OnOff5.2), OnOff6 (R6_OnOff6.2 R9_OnOff6.2 U2_OnOff6.2), OnOff7 (R6_OnOff7.2 R9_OnOff7.2 U2_OnOff7.2), OnOff8 (R6_OnOff8.2 R9_OnOff8.2 U2_OnOff8.2), OnOff9 (R6_OnOff9.2 R9_OnOff9.2 U2_OnOff9.2), OnOff10 (R6_OnOff10.2 R9_OnOff10.2 U2_OnOff10.2), OnOff11 (R6_OnOff11.2 R9_OnOff11.2 U2_OnOff11.2), OnOff12 (R6_OnOff12.2 R9_OnOff12.2 U2_OnOff12.2), OnOff13 (R6_OnOff13.2 R9_OnOff13.2 U2_OnOff13.2), OnOff14 (R6_OnOff14.2 R9_OnOff14.2 U2_OnOff14.2), OnOff15 (R6_OnOff15.2 R9_OnOff15.2 U2_OnOff15.2), OnOff16 (R6_OnOff16.2 R9_OnOff16.2 U2_OnOff16.2), OnOff17 (R6_OnOff17.2 R9_OnOff17.2 U2_OnOff17.2), OnOff18 (R6_OnOff18.2 R9_OnOff18.2 U2_OnOff18.2), OnOff19 (R6_OnOff19.2 R9_OnOff19.2 U2_OnOff19.2), OnOff20 (R6_OnOff20.2 R9_OnOff20.2 U2_OnOff20.2), OnOff21 (R6_OnOff21.2 R9_OnOff21.2 U2_OnOff21.2), OnOff22 (R6_OnOff22.2 R9_OnOff22.2 U2_OnOff22.2), OnOff23 (R6_OnOff23.2 R9_OnOff23.2 U2_OnOff23.2), OnOff24 (R6_OnOff24.2 R9_OnOff24.2 U2_OnOff24.2), OnOff25 (R6_OnOff25.2 R9_OnOff25.2 U2_OnOff25.2), OnOff26 (R6_OnOff26.2 R9_OnOff26.2 U2_OnOff26.2), Sens1 (J2_Sens1.2), Sens2 (J2_Sens2.2), Sens3 (J2_Sens3.2), Sens4 (J2_Sens4.2), Sens5 (J2_Sens5.2), Sens6 (J2_Sens6.2), Sens7 (J2_Sens7.2), Sens8 (J2_Sens8.2)
+12: SoftRoboticsToolKit (C12.1 J11.1 J13.2), MotorDrive (P1.1), PowerSupply (R13.2), Prop1 (P3_Prop1.1), Prop2 (P3_Prop2.1), Prop3 (P3_Prop3.1), Prop4 (P3_Prop4.1), Prop5 (P3_Prop5.1), OnOff1 (P2_OnOff1.1), OnOff2 (P2_OnOff2.1), OnOff3 (P2_OnOff3.1), OnOff4 (P2_OnOff4.1), OnOff5 (P2_OnOff5.1), OnOff6 (P2_OnOff6.1), OnOff7 (P2_OnOff7.1), OnOff8 (P2_OnOff8.1), OnOff9 (P2_OnOff9.1), OnOff10 (P2_OnOff10.1), OnOff11 (P2_OnOff11.1), OnOff12 (P2_OnOff12.1), OnOff13 (P2_OnOff13.1), OnOff14 (P2_OnOff14.1), OnOff15 (P2_OnOff15.1), OnOff16 (P2_OnOff16.1), OnOff17 (P2_OnOff17.1), OnOff18 (P2_OnOff18.1), OnOff19 (P2_OnOff19.1), OnOff20 (P2_OnOff20.1), OnOff21 (P2_OnOff21.1), OnOff22 (P2_OnOff22.1), OnOff23 (P2_OnOff23.1), OnOff24 (P2_OnOff24.1), OnOff25 (P2_OnOff25.1), OnOff26 (P2_OnOff26.1)
+24: SoftRoboticsToolKit (C13.1 J12.1 J14.2), MotorDrive (P1.3), PowerSupply (C6.2 R11.2 U3.1), Prop1 (P3_Prop1.3), Prop2 (P3_Prop2.3), Prop3 (P3_Prop3.3), Prop4 (P3_Prop4.3), Prop5 (P3_Prop5.3), OnOff1 (P2_OnOff1.3), OnOff2 (P2_OnOff2.3), OnOff3 (P2_OnOff3.3), OnOff4 (P2_OnOff4.3), OnOff5 (P2_OnOff5.3), OnOff6 (P2_OnOff6.3), OnOff7 (P2_OnOff7.3), OnOff8 (P2_OnOff8.3), OnOff9 (P2_OnOff9.3), OnOff10 (P2_OnOff10.3), OnOff11 (P2_OnOff11.3), OnOff12 (P2_OnOff12.3), OnOff13 (P2_OnOff13.3), OnOff14 (P2_OnOff14.3), OnOff15 (P2_OnOff15.3), OnOff16 (P2_OnOff16.3), OnOff17 (P2_OnOff17.3), OnOff18 (P2_OnOff18.3), OnOff19 (P2_OnOff19.3), OnOff20 (P2_OnOff20.3), OnOff21 (P2_OnOff21.3), OnOff22 (P2_OnOff22.3), OnOff23 (P2_OnOff23.3), OnOff24 (P2_OnOff24.3), OnOff25 (P2_OnOff25.3), OnOff26 (P2_OnOff26.3)
AGND: SoftRoboticsToolKit (J3.6 J10.6 P4.6 P5.6), Sens1 (J2_Sens1.1 R14_Sens1.2), Sens2 (J2_Sens2.1 R14_Sens2.2), Sens3 (J2_Sens3.1 R14_Sens3.2), Sens4 (J2_Sens4.1 R14_Sens4.2), Sens5 (J2_Sens5.1 R14_Sens5.2), Sens6 (J2_Sens6.1 R14_Sens6.2), Sens7 (J2_Sens7.1 R14_Sens7.2), Sens8 (J2_Sens8.1 R14_Sens8.2)
GND: SoftRoboticsToolKit (65 pins), MotorDrive (12 pins), PowerSupply (7 pins), Prop1 (8 pins), Prop2 (8 pins), Prop3 (8 pins), Prop4 (8 pins), Prop5 (8 pins), OnOff1 (5 pins), OnOff2 (5 pins), OnOff3 (5 pins), OnOff4 (5 pins), OnOff5 (5 pins), OnOff6 (5 pins), OnOff7 (5 pins), OnOff8 (5 pins), OnOff9 (5 pins), OnOff10 (5 pins), OnOff11 (5 pins), OnOff12 (5 pins), OnOff13 (5 pins), OnOff14 (5 pins), OnOff15 (5 pins), OnOff16 (5 pins), OnOff17 (5 pins), OnOff18 (5 pins), OnOff19 (5 pins), OnOff20 (5 pins), OnOff21 (5 pins), OnOff22 (5 pins), OnOff23 (5 pins), OnOff24 (5 pins), OnOff25 (5 pins), OnOff26 (5 pins)
AI1: SoftRoboticsToolKit (J3.3 P4.3), Sens1 (J2_Sens1.3 R14_Sens1.1)
AI2: SoftRoboticsToolKit (J3.5 P4.5), Sens2 (J2_Sens2.3 R14_Sens2.1)
AI3: SoftRoboticsToolKit (J3.7 P4.7), Sens3 (J2_Sens3.3 R14_Sens3.1)
AI4: SoftRoboticsToolKit (J3.9 P4.9), Sens4 (J2_Sens4.3 R14_Sens4.1)
AI5: SoftRoboticsToolKit (J10.3 P5.3), Sens5 (J2_Sens5.3 R14_Sens5.1)
AI6: SoftRoboticsToolKit (J10.5 P5.5), Sens6 (J2_Sens6.3 R14_Sens6.1)
AI7: SoftRoboticsToolKit (J10.7 P5.7), Sens7 (J2_Sens7.3 R14_Sens7.1)
AI8: SoftRoboticsToolKit (J10.9 P5.9), Sens8 (J2_Sens8.3 R14_Sens8.1)
DIO1: SoftRoboticsToolKit (J3.11 P4.11), OnOff1 (R7_OnOff1.1 R8_OnOff1.1)
DIO2: SoftRoboticsToolKit (J3.13 P4.13), OnOff2 (R7_OnOff2.1 R8_OnOff2.1)
DIO3: SoftRoboticsToolKit (J3.15 P4.15), OnOff3 (R7_OnOff3.1 R8_OnOff3.1)
DIO4: SoftRoboticsToolKit (J3.17 P4.17), OnOff4 (R7_OnOff4.1 R8_OnOff4.1)
DIO5: SoftRoboticsToolKit (J3.18 P4.18), OnOff5 (R7_OnOff5.1 R8_OnOff5.1)
DIO6: SoftRoboticsToolKit (J3.19 P4.19), OnOff6 (R7_OnOff6.1 R8_OnOff6.1)
DIO7: SoftRoboticsToolKit (J3.21 P4.21), OnOff7 (R7_OnOff7.1 R8_OnOff7.1)
DIO8: SoftRoboticsToolKit (J3.22 P4.22), OnOff8 (R7_OnOff8.1 R8_OnOff8.1)
DIO9: SoftRoboticsToolKit (J3.23 P4.23), OnOff9 (R7_OnOff9.1 R8_OnOff9.1)
DIO10: SoftRoboticsToolKit (J3.25 P4.25), OnOff10 (R7_OnOff10.1 R8_OnOff10.1)
DIO11: SoftRoboticsToolKit (J3.26 P4.26), OnOff11 (R7_OnOff11.1 R8_OnOff11.1)
DIO12: SoftRoboticsToolKit (J3.32 P4.32), OnOff12 (R7_OnOff12.1 R8_OnOff12.1)
DIO13: SoftRoboticsToolKit (J3.34 P4.34), OnOff13 (R7_OnOff13.1 R8_OnOff13.1)
DIO14: SoftRoboticsToolKit (J10.11 P5.11), OnOff14 (R7_OnOff14.1 R8_OnOff14.1)
DIO15: SoftRoboticsToolKit (J10.13 P5.13), OnOff15 (R7_OnOff15.1 R8_OnOff15.1)
DIO16: SoftRoboticsToolKit (J10.15 P5.15), OnOff16 (R7_OnOff16.1 R8_OnOff16.1)
DIO17: SoftRoboticsToolKit (J10.17 P5.17), OnOff17 (R7_OnOff17.1 R8_OnOff17.1)
DIO18: SoftRoboticsToolKit (J10.18 P5.18), OnOff18 (R7_OnOff18.1 R8_OnOff18.1)
DIO19: SoftRoboticsToolKit (J10.19 P5.19), OnOff19 (R7_OnOff19.1 R8_OnOff19.1)
DIO20: SoftRoboticsToolKit (J10.21 P5.21), OnOff20 (R7_OnOff20.1 R8_OnOff20.1)
DIO21: SoftRoboticsToolKit (J10.22 P5.22), OnOff21 (R7_OnOff21.1 R8_OnOff21.1)
DIO22: SoftRoboticsToolKit (J10.23 P5.23), OnOff22 (R7_OnOff22.1 R8_OnOff22.1)
DIO23: SoftRoboticsToolKit (J10.25 P5.25), OnOff23 (R7_OnOff23.1 R8_OnOff23.1)
DIO24: SoftRoboticsToolKit (J10.26 P5.26), OnOff24 (R7_OnOff24.1 R8_OnOff24.1)
DIO25: SoftRoboticsToolKit (J10.32 P5.32), OnOff25 (R7_OnOff25.1 R8_OnOff25.1)
DIO26: SoftRoboticsToolKit (J10.34 P5.34), OnOff26 (R7_OnOff26.1 R8_OnOff26.1)
PWM1: SoftRoboticsToolKit (J3.29 P4.29), Prop1 (R16_Prop1.1 U4_Prop1.3)
PWM2: SoftRoboticsToolKit (J3.31 P4.31), Prop2 (R16_Prop2.1 U4_Prop2.3)
PWM3: SoftRoboticsToolKit (J10.27 P5.27), Prop3 (R16_Prop3.1 U4_Prop3.3)
PWM4: SoftRoboticsToolKit (J10.29 P5.29), Prop4 (R16_Prop4.1 U4_Prop4.3)
PWM5: SoftRoboticsToolKit (J10.31 P5.31), Prop5 (R16_Prop5.1 U4_Prop5.3)
PWMM: SoftRoboticsToolKit (J3.27 P4.27), MotorDrive (R2.1 U1.3)
SO1: SoftRoboticsToolKit (J9.2), OnOff1 (D5_OnOff1.1 U2_OnOff1.7)
SO2: SoftRoboticsToolKit (J6.12), OnOff2 (D5_OnOff2.1 U2_OnOff2.7)
SO3: SoftRoboticsToolKit (J6.10), OnOff3 (D5_OnOff3.1 U2_OnOff3.7)
SO4: SoftRoboticsToolKit (J6.8), OnOff4 (D5_OnOff4.1 U2_OnOff4.7)
SO5: SoftRoboticsToolKit (J6.6), OnOff5 (D5_OnOff5.1 U2_OnOff5.7)
SO6: SoftRoboticsToolKit (J6.4), OnOff6 (D5_OnOff6.1 U2_OnOff6.7)
SO7: SoftRoboticsToolKit (J6.2), OnOff7 (D5_OnOff7.1 U2_OnOff7.7)
SO8: SoftRoboticsToolKit (J5.12), OnOff8 (D5_OnOff8.1 U2_OnOff8.7)
SO9: SoftRoboticsToolKit (J5.10), OnOff9 (D5_OnOff9.1 U2_OnOff9.7)
SO10: SoftRoboticsToolKit (J5.8), OnOff10 (D5_OnOff10.1 U2_OnOff10.7)
SO11: SoftRoboticsToolKit (J5.6), OnOff11 (D5_OnOff11.1 U2_OnOff11.7)
SO12: SoftRoboticsToolKit (J5.4), OnOff12 (D5_OnOff12.1 U2_OnOff12.7)
SO13: SoftRoboticsToolKit (J5.2), OnOff13 (D5_OnOff13.1 U2_OnOff13.7)
SO14: SoftRoboticsToolKit (J7.12), OnOff14 (D5_OnOff14.1 U2_OnOff14.7)
SO15: SoftRoboticsToolKit (J7.10), OnOff15 (D5_OnOff15.1 U2_OnOff15.7)
SO16: SoftRoboticsToolKit (J7.8), OnOff16 (D5_OnOff16.1 U2_OnOff16.7)
SO17: SoftRoboticsToolKit (J7.6), OnOff17 (D5_OnOff17.1 U2_OnOff17.7)
SO18: SoftRoboticsToolKit (J7.4), OnOff18 (D5_OnOff18.1 U2_OnOff18.7)
SO19: SoftRoboticsToolKit (J7.2), OnOff19 (D5_OnOff19.1 U2_OnOff19.7)
SO20: SoftRoboticsToolKit (J8.12), OnOff20 (D5_OnOff20.1 U2_OnOff20.7)
SO21: SoftRoboticsToolKit (J8.10), OnOff21 (D5_OnOff21.1 U2_OnOff21.7)
SO22: SoftRoboticsToolKit (J8.8), OnOff22 (D5_OnOff22.1 U2_OnOff22.7)
SO23: SoftRoboticsToolKit (J8.6), OnOff23 (D5_OnOff23.1 U2_OnOff23.7)
SO24: SoftRoboticsToolKit (J8.4), OnOff24 (D5_OnOff24.1 U2_OnOff24.7)
SO25: SoftRoboticsToolKit (J8.2), OnOff25 (D5_OnOff25.1 U2_OnOff25.7)
SO26: SoftRoboticsToolKit (J4.12), OnOff26 (D5_OnOff26.1 U2_OnOff26.7)
SP1: SoftRoboticsToolKit (J4.10), Prop1 (C11_Prop1.2 L2_Prop1.2)
SP2: SoftRoboticsToolKit (J4.8), Prop2 (C11_Prop2.2 L2_Prop2.2)
SP3: SoftRoboticsToolKit (J4.6), Prop3 (C11_Prop3.2 L2_Prop3.2)
SP4: SoftRoboticsToolKit (J4.4), Prop4 (C11_Prop4.2 L2_Prop4.2)
SP5: SoftRoboticsToolKit (J4.2), Prop5 (C11_Prop5.2 L2_Prop5.2)